# Altium schematic sheet SN74HC.schdoc
size 54 x 45 mm
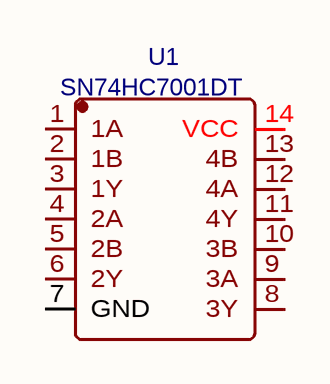
[diagram p0: SN74HC.schdoc]

## Parts
U1  SN74HC7001DT  [SOIC-14_L8.7-W3.9-P1.27-LS6.0-BL]

## Nets

Not connected (* = marked no-connect by the designer): U1 1(1A) 2(1B) 3(1Y) 4(2A) 5(2B) 6(2Y) 7(GND) 8(3Y) 9(3A) 10(3B) 11(4Y) 12(4A) 13(4B) 14(VCC)

## Library data of the parts
U1 = SN74HC7001DT: BOM_Manufacturer: Texas Instruments; Contributor: LCSC; SMT Type: Extend; BOM_Supplier: LCSC; BOM_Supplier Part: C132100; BOM_Manufacturer Part: SN74HC7001DT; BOM_JLCPCB SMD: Yes; spicePre: U; spiceSymbolName: SN74HC7001DT